# EAGLE design QFN44-TQFP44 (EAGLE 7.2.0)
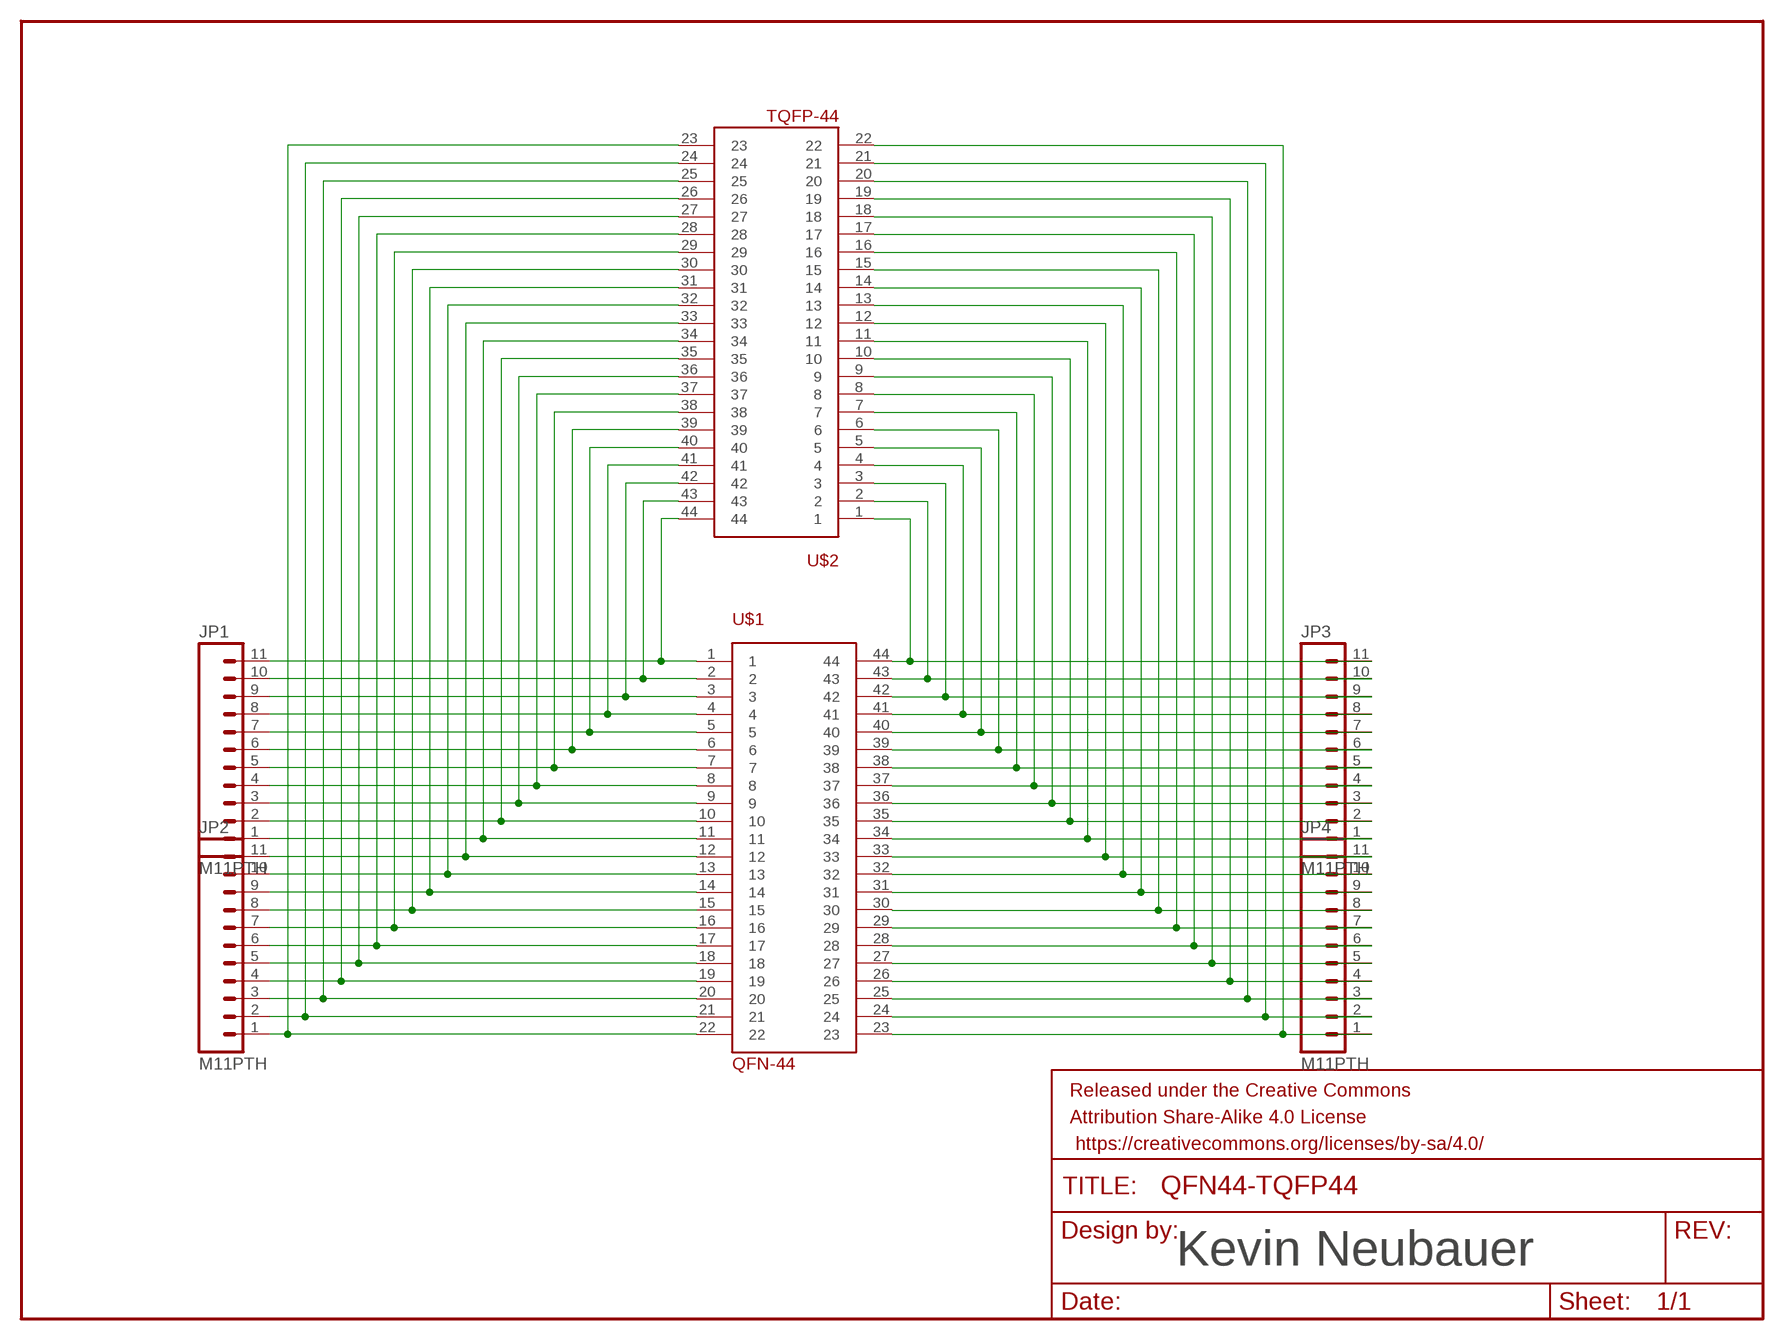
[diagram p0: schematic, sheet 1]

## Parts
FRAME1  FRAME-LETTER  [CREATIVE_COMMONS]
JP1  M11PTH  [1X11]
JP2  M11PTH  [1X11]
JP3  M11PTH  [1X11]
JP4  M11PTH  [1X11]
U$1  QFN-44  [QFN-44]
U$2  TQFP-44  [TQFP44]

## Nets
N$1: JP1.11 U$1.1 U$2.44
N$2: JP1.10 U$1.2 U$2.43
N$3: JP1.9 U$1.3 U$2.42
N$4: JP1.8 U$1.4 U$2.41
N$5: JP1.7 U$1.5 U$2.40
N$6: JP1.6 U$1.6 U$2.39
N$7: JP1.5 U$1.7 U$2.38
N$8: JP1.4 U$1.8 U$2.37
N$9: JP1.3 U$1.9 U$2.36
N$10: JP1.2 U$1.10 U$2.35
N$11: JP1.1 U$1.11 U$2.34
N$12: JP2.11 U$1.12 U$2.33
N$13: JP2.10 U$1.13 U$2.32
N$14: JP2.9 U$1.14 U$2.31
N$15: JP2.8 U$1.15 U$2.30
N$16: JP2.7 U$1.16 U$2.29
N$17: JP2.6 U$1.17 U$2.28
N$18: JP2.5 U$1.18 U$2.27
N$19: JP2.4 U$1.19 U$2.26
N$20: JP2.3 U$1.20 U$2.25
N$21: JP2.2 U$1.21 U$2.24
N$22: JP2.1 U$1.22 U$2.23
N$23: JP3.11 U$1.44 U$2.1
N$24: JP3.10 U$1.43 U$2.2
N$27: JP3.7 U$1.40 U$2.5
N$28: JP3.6 U$1.39 U$2.6
N$29: JP3.5 U$1.38 U$2.7
N$30: JP3.4 U$1.37 U$2.8
N$31: JP3.3 U$1.36 U$2.9
N$32: JP3.2 U$1.35 U$2.10
N$33: JP3.1 U$1.34 U$2.11
N$34: JP4.11 U$1.33 U$2.12
N$35: JP4.10 U$1.32 U$2.13
N$36: JP4.9 U$1.31 U$2.14
N$37: JP4.8 U$1.30 U$2.15
N$38: JP4.7 U$1.29 U$2.16
N$39: JP4.6 U$1.28 U$2.17
N$40: JP4.5 U$1.27 U$2.18
N$41: JP4.4 U$1.26 U$2.19
N$42: JP4.3 U$1.25 U$2.20
N$43: JP4.2 U$1.24 U$2.21
N$44: JP4.1 U$1.23 U$2.22
N$45: JP3.9 U$1.42 U$2.3
N$46: JP3.8 U$1.41 U$2.4

## Notes on the sheet
- Kevin Neubauer

## Library data of the parts
FRAME1 = SparkFun-Aesthetics:FRAME-LETTER: Schematic Frame Standard 8.5x11 US Letter frame
JP1-JP4 = SparkFun-Connectors:M11: Header 11 Standard 11-pin 0.1" header. Use with straight break away headers (SKU : PRT-00116), right angle break away headers (PRT-00553), swiss pins (PRT-00743), machine pins (PRT-00117), and female headers (PRT-00115).
U$1 = Kevin-GenericICFootprints:QFN-44
U$2 = Kevin-GenericICFootprints:TQFP-44

## Board
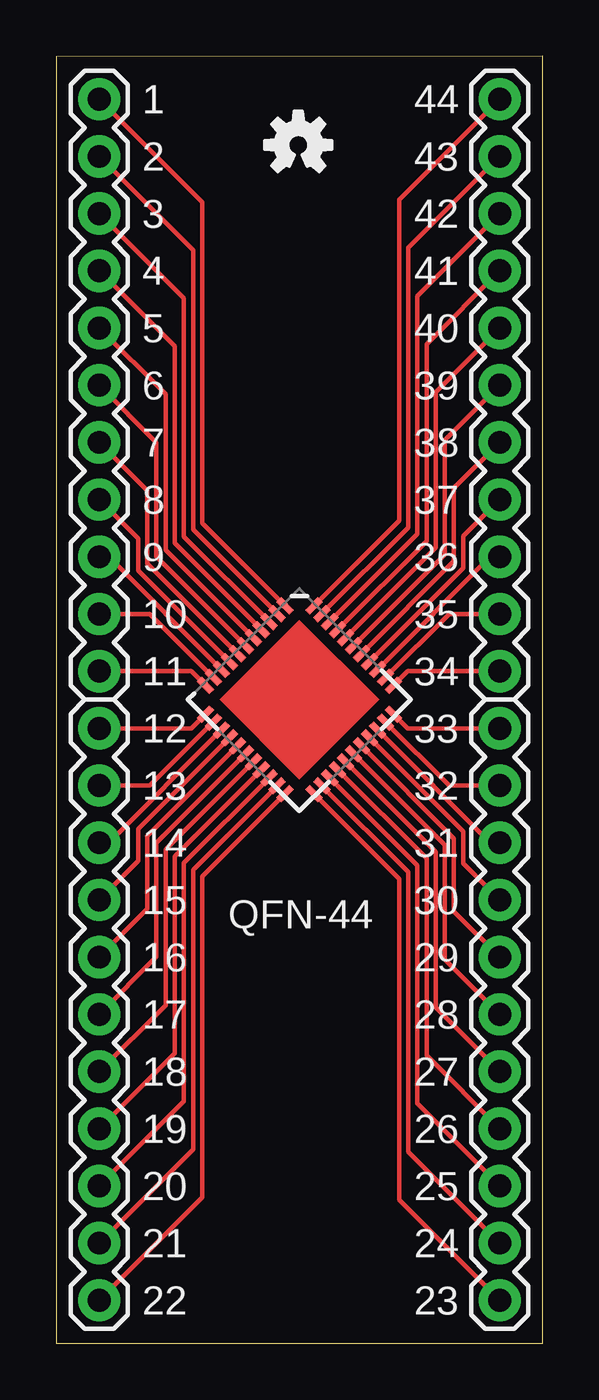
[diagram p1: board, top side]
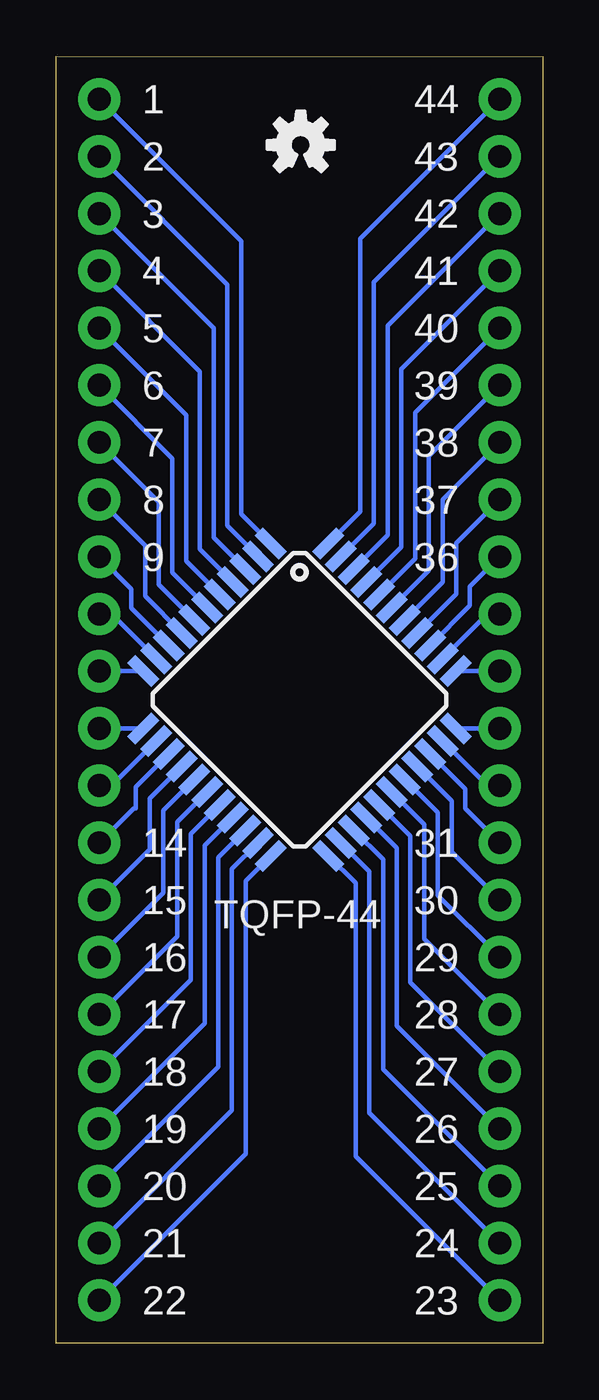
[diagram p2: board, bottom side, seen from below]

Size 21.59 x 57.15 mm. Coordinates in mm from the lower left corner, seen from the top.
Outline: 0,0 21.59,0 21.59,57.15 0,57.14 0,0
Copper layers (1*16): Top 0.035mm / dielectric 1.5mm / Bottom 0.035mm
Design rules "dirt_cheap_dirty_boards.v1": minimum track width 5mil, minimum drill 12mil, track to track 5mil, track to pad 5mil, pad to pad 5mil, via to via 5mil, smd to smd 0mil, copper to edge 10mil, drill to drill 10mil, minimum pad ring 10mil, minimum via ring 6mil, stop-mask expansion 2mil, vias tented up to drill 25mil, thermal gap 10mil

### Footprints (pad centres in the part's own frame; a part is rotated, then mirrored left to right if it is on the bottom)
1X11 = drill 1.016 pad 1.88: 1 0,0; 2 2.54,0; 3 5.08,0; 4 7.62,0; 5 10.16,0; 6 12.7,0; 7 15.24,0; 8 17.78,0; 9 20.32,0; 10 22.86,0; 11 25.4,0
QFN-44 = smd 0.8 x 0.3: 1 -3.4,2.5; 2 -3.4,2; 3 -3.4,1.5; 4 -3.4,1; 5 -3.4,0.5; 6 -3.4,0; 7 -3.4,-0.5; 8 -3.4,-1; 9 -3.4,-1.5; 10 -3.4,-2; 11 -3.4,-2.5; 23 3.4,-2.5; 24 3.4,-2; 25 3.4,-1.5; 26 3.4,-1; 27 3.4,-0.5; 28 3.4,0; 29 3.4,0.5; 30 3.4,1; 31 3.4,1.5; 32 3.4,2; 33 3.4,2.5 | smd 0.3 x 0.8: 12 -2.5,-3.4; 13 -2,-3.4; 14 -1.5,-3.4; 15 -1,-3.4; 16 -0.5,-3.4; 17 0,-3.4; 18 0.5,-3.4; 19 1,-3.4; 20 1.5,-3.4; 21 2,-3.4; 22 2.5,-3.4; 34 2.5,3.4; 35 2,3.4; 36 1.5,3.4; 37 1,3.4; 38 0.5,3.4; 39 0,3.4; 40 -0.5,3.4; 41 -1,3.4; 42 -1.5,3.4; 43 -2,3.4; 44 -2.5,3.4
TQFP44 = smd 1.5 x 0.5: 1 -5.8,4; 2 -5.8,3.2; 3 -5.8,2.4; 4 -5.8,1.6; 5 -5.8,0.8; 6 -5.8,0; 7 -5.8,-0.8; 8 -5.8,-1.6; 9 -5.8,-2.4; 10 -5.8,-3.2; 11 -5.8,-4; 23 5.8,-4; 24 5.8,-3.2; 25 5.8,-2.4; 26 5.8,-1.6; 27 5.8,-0.8; 28 5.8,0; 29 5.8,0.8; 30 5.8,1.6; 31 5.8,2.4; 32 5.8,3.2; 33 5.8,4 | smd 0.5 x 1.5: 12 -4,-5.8; 13 -3.2,-5.8; 14 -2.4,-5.8; 15 -1.6,-5.8; 16 -0.8,-5.8; 17 0,-5.8; 18 0.8,-5.8; 19 1.6,-5.8; 20 2.4,-5.8; 21 3.2,-5.8; 22 4,-5.8; 34 4,5.8; 35 3.2,5.8; 36 2.4,5.8; 37 1.6,5.8; 38 0.8,5.8; 39 0,5.8; 40 -0.8,5.8; 41 -1.6,5.8; 42 -2.4,5.8; 43 -3.2,5.8; 44 -4,5.8

### Placement (x,y rotation side)
FRAME1  -10.79,-8.26 0 top  (outside the outline)
JP1  1.91,29.84 90 top
JP2  1.91,1.91 90 top
JP3  19.68,29.84 90 top
JP4  19.68,1.91 90 top
U$1  10.79,28.57 315 top
U$2  10.79,28.57 315 bottom
U$3  [OSHW-LOGO-S]  10.74,53.21 0 top
U$4  [OSHW-LOGO-S]  10.74,53.21 0 bottom

### Tracks (layer width: path | path; a pad name or v marks a point on that pad's centre or on a via)
N$1
  Top 0.203: U$1.1 6.48,36.43 6.48,48.74 6.48,48.95 6.48,50.67 JP1.11
  Bottom 0.203: U$2.44 8.1,36.92 8.1,49.05 JP1.11
N$2
  Top 0.203: U$1.2 6.07,36.13 6.07,46.3 6.07,46.71 6.07,48.54 JP1.10
  Bottom 0.203: U$2.43 7.49,36.4 7.49,47.12 JP1.10
N$3
  Top 0.203: U$1.3 5.66,35.83 5.66,44.48 5.66,44.88 5.66,46.41 JP1.9
  Bottom 0.203: U$2.42 6.88,35.88 6.88,45.19 JP1.9
N$4
  Top 0.203: U$1.4 5.26,35.53 5.26,44.27 JP1.8
  Bottom 0.203: U$2.41 6.27,35.36 6.27,43.26 JP1.8
N$5
  Top 0.203: U$1.5 4.85,35.23 4.85,42.14 JP1.7
  Bottom 0.203: U$2.40 5.66,34.84 5.66,41.33 JP1.7
N$6
  Top 0.203: U$1.6 4.45,34.93 4.45,40.01 JP1.6
  Bottom 0.203: U$2.39 5.06,34.32 5.06,39.4 JP1.6
N$7
  Top 0.203: U$1.7 4.04,34.62 4.04,37.87 JP1.5
  Bottom 0.203: U$2.38 4.45,33.79 4.45,37.47 JP1.5
N$8
  Top 0.203: U$1.8 3.63,34.32 3.63,35.74 JP1.4
  Bottom 0.203: U$2.37 3.83,33.27 3.83,35.54 JP1.4
N$9
  Top 0.203: U$1.9 2.32,34.93 JP1.3
  Bottom 0.203: U$2.36 3.23,32.75 3.23,33.6 JP1.3
N$10
  Top 0.203: U$1.10 4.16,32.39 JP1.2
  Bottom 0.203: U$2.35 2.46,32.39 JP1.2
N$11
  Top 0.203: U$1.11 5.99,29.84 JP1.1
  Bottom 0.203: U$2.34 JP1.1
N$12
  Top 0.203: U$1.12 5.99,27.3 JP2.11
  Bottom 0.203: U$2.33 JP2.11
N$13
  Top 0.203: U$1.13 4.16,24.76 JP2.10
  Bottom 0.203: U$2.32 2.46,24.76 JP2.10
N$14
  Top 0.203: U$1.14 2.32,22.22 JP2.9
  Bottom 0.203: U$2.31 3.43,24.6 3.43,23.75 JP2.9
N$15
  Top 0.203: U$1.15 3.63,22.83 3.63,21.41 JP2.8
  Bottom 0.203: U$2.30 4.04,24.08 4.04,21.82 JP2.8
N$16
  Top 0.203: U$1.16 4.04,22.53 4.04,19.28 JP2.7
  Bottom 0.203: U$2.29 4.65,23.56 4.65,19.89 JP2.7
N$17
  Top 0.203: U$1.17 4.45,22.22 4.45,17.14 JP2.6
  Bottom 0.203: U$2.28 5.26,23.04 5.26,17.96 JP2.6
N$18
  Top 0.203: U$1.18 4.85,21.92 4.85,15.01 JP2.5
  Bottom 0.203: U$2.27 5.87,22.52 5.87,16.03 JP2.5
N$19
  Top 0.203: U$1.19 5.26,21.62 5.26,12.88 JP2.4
  Bottom 0.203: U$2.26 6.48,21.99 6.48,14.1 JP2.4
N$20
  Top 0.203: U$1.20 5.66,21.32 5.66,10.74 JP2.3
  Bottom 0.203: U$2.25 7.09,21.47 7.09,12.17 JP2.3
N$21
  Top 0.203: U$1.21 6.07,21.02 6.07,8.61 JP2.2
  Bottom 0.203: U$2.24 7.7,20.95 7.7,10.24 JP2.2
N$22
  Top 0.203: U$1.22 6.48,20.72 6.48,6.48 JP2.1
  Bottom 0.203: U$2.23 8.31,20.43 8.31,8.71 8.31,8.51 8.31,8.31 JP2.1
N$23
  Top 0.203: U$1.44 15.21,36.53 15.21,48.34 15.21,48.95 15.21,50.77 JP3.11
  Bottom 0.203: U$2.1 13.39,36.82 13.39,46.71 13.39,47.32 13.39,48.95 JP3.11
N$24
  Top 0.203: U$1.43 15.62,36.23 15.62,48.64 JP3.10
  Bottom 0.203: U$2.2 14,36.3 14,47.02 JP3.10
N$27
  Top 0.203: U$1.40 16.84,35.33 16.84,39.8 16.84,40.82 16.84,42.24 JP3.7
  Bottom 0.203: U$2.5 15.82,34.74 15.82,41.22 JP3.7
N$28
  Top 0.203: U$1.39 17.25,35.03 17.25,37.77 17.25,38.79 17.25,40.11 JP3.6
  Bottom 0.203: U$2.6 16.43,34.21 16.43,37.36 16.43,38.18 16.43,39.29 JP3.6
N$29
  Top 0.203: U$1.38 17.65,34.73 17.65,37.97 JP3.5
  Bottom 0.203: U$2.7 17.04,33.69 17.04,35.33 17.04,35.94 17.04,37.36 JP3.5
N$30
  Top 0.203: U$1.37 18.06,34.43 18.06,35.84 JP3.4
  Bottom 0.203: U$2.8 17.65,33.17 17.65,34.11 17.65,34.52 17.65,35.43 JP3.4
N$31
  Top 0.203: U$1.36 19.27,34.93 JP3.3
  Bottom 0.203: U$2.9 18.26,32.65 18.26,33.5 JP3.3
N$32
  Top 0.203: U$1.35 17.43,32.39 JP3.2
  Bottom 0.203: U$2.10 19.13,32.39 JP3.2
N$33
  Top 0.203: U$1.34 15.6,29.84 JP3.1
  Bottom 0.203: U$2.11 JP3.1
N$34
  Top 0.203: U$1.33 15.6,27.3 JP4.11
  Bottom 0.203: U$2.12 JP4.11
N$35
  Top 0.203: U$1.32 17.43,24.76 JP4.10
  Bottom 0.203: U$2.13 19.13,24.76 JP4.10
N$36
  Top 0.203: U$1.31 19.27,22.22 JP4.9
  Bottom 0.203: U$2.14 18.06,24.7 18.06,23.75 18.16,23.75 JP4.9
N$37
  Top 0.203: U$1.30 18.06,22.72 18.06,21.31 JP4.8
  Bottom 0.203: U$2.15 17.45,24.18 17.45,21.92 JP4.8
N$38
  Top 0.203: U$1.29 17.65,22.42 17.65,19.18 JP4.7
  Bottom 0.203: U$2.16 16.84,23.66 16.84,19.99 JP4.7
N$39
  Top 0.203: U$1.28 17.25,22.12 17.25,17.04 JP4.6
  Bottom 0.203: U$2.17 16.23,23.14 16.23,18.06 JP4.6
N$40
  Top 0.203: U$1.27 16.84,21.82 16.84,14.91 JP4.5
  Bottom 0.203: U$2.18 15.62,22.62 15.62,16.13 JP4.5
N$41
  Top 0.203: U$1.26 16.43,21.52 16.43,12.78 JP4.4
  Bottom 0.203: U$2.19 15.01,22.1 15.01,14.2 JP4.4
N$42
  Top 0.203: U$1.25 16.03,21.22 16.03,12.98 16.03,12.57 16.03,10.64 JP4.3
  Bottom 0.203: U$2.20 14.4,21.57 14.4,12.27 JP4.3
N$43
  Top 0.203: U$1.24 15.62,20.92 15.62,8.51 JP4.2
  Bottom 0.203: U$2.21 13.79,21.05 13.79,10.34 JP4.2
N$44
  Top 0.203: U$1.23 15.21,20.62 15.21,6.38 JP4.1
  Bottom 0.203: U$2.22 13.18,20.53 13.18,10.34 13.18,9.73 13.18,8.41 JP4.1
N$45
  Top 0.203: U$1.42 16.03,35.93 16.03,46.51 JP3.9
  Bottom 0.203: U$2.3 14.61,35.78 14.61,45.09 JP3.9
N$46
  Top 0.203: U$1.41 16.43,35.63 16.43,44.37 JP3.8
  Bottom 0.203: U$2.4 15.21,35.26 15.21,41.22 15.21,41.63 15.21,43.16 JP3.8

### Text on the board
tPlace: 1 | 44 | 2 | 43 | 3 | 42 | 4 | 41 | 5 | 40 | 6 | 39 | 7 | 38 | 8 | 37 | 9 | 36 | 10 | 35 | 11 | 34 | 12 | 33 | 13 | 32 | 14 | 31 | 15 | 30 | QFN-44 | 16 | 29 | 17 | 28 | 18 | 27 | 19 | 26 | 20 | 25 | 21 | 24 | 22 | 23
bPlace: 44 | 1 | 43 | 2 | 42 | 3 | 41 | 4 | 40 | 5 | 39 | 6 | 38 | 7 | 37 | 8 | 36 | 9 | 31 | 14 | 30 | 15 | TQFP-44 | 29 | 16 | 28 | 17 | 27 | 18 | 26 | 19 | 25 | 20 | 24 | 21 | 23 | 22
tDocu: Kevin Neubauer